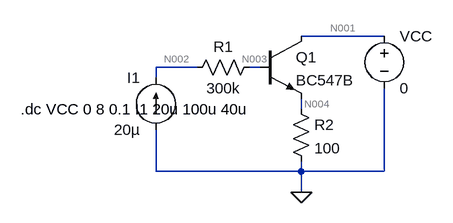
[diagram p0: schematic CC_CORRECTED.asc]
CC_CORRECTED.asc, the LTspice schematic file:
Version 4.1
SHEET 1 880 680
WIRE 352 112 224 112
WIRE 64 160 0 160
WIRE 160 160 144 160
WIRE 0 176 0 160
WIRE 224 224 224 208
WIRE 0 320 0 256
WIRE 224 320 224 304
WIRE 224 320 0 320
WIRE 352 320 352 192
WIRE 352 320 224 320
WIRE 224 352 224 320
FLAG 224 352 0
SYMBOL npn 160 112 R0
SYMATTR InstName Q1
SYMATTR Value BC547B
SYMBOL voltage 352 96 R0
SYMATTR InstName VCC
SYMATTR Value 0
SYMBOL res 160 144 R90
WINDOW 0 0 56 VBottom 2
WINDOW 3 32 56 VTop 2
SYMATTR InstName R1
SYMATTR Value 300k
SYMBOL res 208 208 R0
SYMATTR InstName R2
SYMATTR Value 100
SYMBOL current 0 256 R180
WINDOW 0 24 80 Left 2
WINDOW 3 24 0 Left 2
SYMATTR InstName I1
SYMATTR Value 20µ
TEXT -208 224 Left 2 !.dc VCC 0 8 0.1 I1 20u 100u 40u

The netlist it stands for:
* CC_CORRECTED.asc
Q1 N001 N003 N004 0 BC547B
VCC N001 0 0
R1 N003 N002 300k
R2 N004 0 100
I1 0 N002 20µ
.model NPN NPN
.model PNP PNP
.lib standard.bjt
.dc VCC 0 8 0.1 I1 20u 100u 40u
.backanno
.end

* Results of the author's LTspice run, read from the files saved beside the schematic
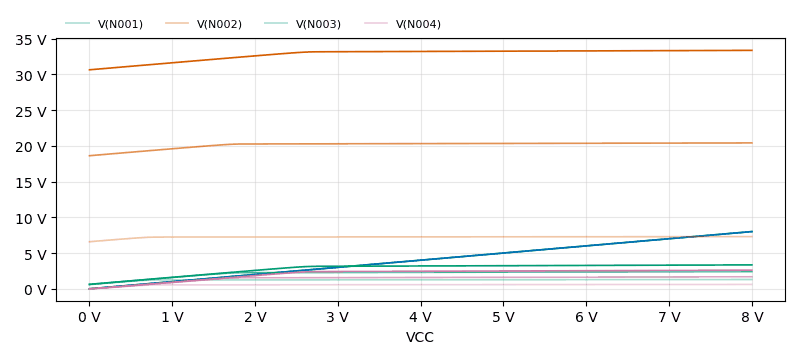
[diagram p1: DC transfer characteristic of CC_CORRECTED.asc, plotted from the saved traces]
* DC transfer characteristic, 3 runs:
*   V(N001) [I1=2e-05]: 0 V at VCC=0 V, 8 V at VCC=8 V, min 0 V, max 8 V
*   V(N001) [I1=6e-05]: 0 V at VCC=0 V, 8 V at VCC=8 V, min 0 V, max 8 V
*   V(N001) [I1=0.0001]: 0 V at VCC=0 V, 8 V at VCC=8 V, min 0 V, max 8 V
*   V(N002) [I1=2e-05]: 6.58 V at VCC=0 V, 7.296 V at VCC=8 V, min 6.58 V, max 7.296 V
*   V(N002) [I1=6e-05]: 18.61 V at VCC=0 V, 20.4 V at VCC=8 V, min 18.61 V, max 20.4 V
*   V(N002) [I1=0.0001]: 30.62 V at VCC=0 V, 33.34 V at VCC=8 V, min 30.62 V, max 33.34 V
*   V(N003) [I1=2e-05]: 580.4 mV at VCC=0 V, 1.296 V at VCC=8 V, min 580.4 mV, max 1.296 V
*   V(N003) [I1=6e-05]: 610.1 mV at VCC=0 V, 2.399 V at VCC=8 V, min 610.1 mV, max 2.399 V
*   V(N003) [I1=0.0001]: 623.9 mV at VCC=0 V, 3.342 V at VCC=8 V, min 623.9 mV, max 3.342 V
*   V(N004) [I1=2e-05]: -666.9 µV at VCC=0 V, 609.1 mV at VCC=8 V, min -666.9 µV, max 609.1 mV
*   V(N004) [I1=6e-05]: -1.314 mV at VCC=0 V, 1.679 V at VCC=8 V, min -1.314 mV, max 1.679 V
*   V(N004) [I1=0.0001]: -1.6 mV at VCC=0 V, 2.603 V at VCC=8 V, min -1.6 mV, max 2.603 V